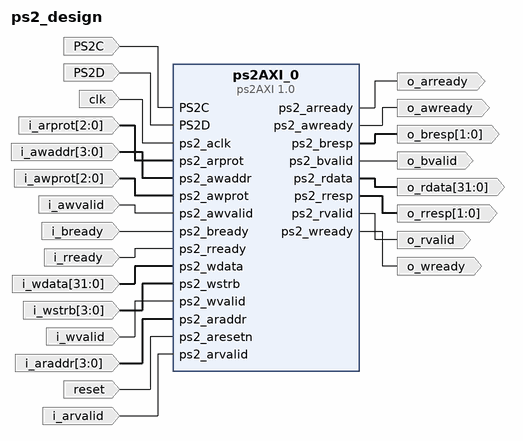
[diagram p0: block diagram of the top level]
# Vivado block design ps2_design, xc7z010clg400-1, Vivado 2023.1
create_bd_design ps2_design

create_bd_port -dir I reset
create_bd_port -dir I -type clk clk
set_property -dict {CONFIG.FREQ_HZ 125000000} [get_bd_ports clk]
create_bd_port -dir I -type data PS2C
create_bd_port -dir I -type data PS2D
create_bd_port -dir I -from 3 -to 0 i_araddr
create_bd_port -dir I i_arvalid
create_bd_port -dir O o_rvalid
create_bd_port -dir I -from 2 -to 0 i_arprot
create_bd_port -dir O o_arready
create_bd_port -dir O -from 31 -to 0 o_rdata
create_bd_port -dir O -from 1 -to 0 o_rresp
create_bd_port -dir I i_rready
create_bd_port -dir I i_bready
create_bd_port -dir O o_bvalid
create_bd_port -dir O -from 1 -to 0 o_bresp
create_bd_port -dir O o_wready
create_bd_port -dir I i_wvalid
create_bd_port -dir I -from 3 -to 0 i_wstrb
create_bd_port -dir I -from 31 -to 0 i_wdata
create_bd_port -dir I -from 3 -to 0 i_awaddr
create_bd_port -dir I -from 2 -to 0 i_awprot
create_bd_port -dir I i_awvalid
create_bd_port -dir O o_awready

create_bd_cell -type ip -vlnv user.org:user:ps2AXI:1.0 ps2AXI_0

# ---- connections ----

connect_bd_net [get_bd_ports PS2C] [get_bd_pins ps2AXI_0/PS2C]
connect_bd_net [get_bd_ports PS2D] [get_bd_pins ps2AXI_0/PS2D]
connect_bd_net [get_bd_ports clk] [get_bd_pins ps2AXI_0/ps2_aclk]
connect_bd_net [get_bd_ports i_arprot] [get_bd_pins ps2AXI_0/ps2_arprot]
connect_bd_net [get_bd_ports i_awaddr] [get_bd_pins ps2AXI_0/ps2_awaddr]
connect_bd_net [get_bd_ports i_awprot] [get_bd_pins ps2AXI_0/ps2_awprot]
connect_bd_net [get_bd_ports i_awvalid] [get_bd_pins ps2AXI_0/ps2_awvalid]
connect_bd_net [get_bd_ports i_bready] [get_bd_pins ps2AXI_0/ps2_bready]
connect_bd_net [get_bd_ports i_rready] [get_bd_pins ps2AXI_0/ps2_rready]
connect_bd_net [get_bd_ports i_wdata] [get_bd_pins ps2AXI_0/ps2_wdata]
connect_bd_net [get_bd_ports i_wstrb] [get_bd_pins ps2AXI_0/ps2_wstrb]
connect_bd_net [get_bd_ports i_wvalid] [get_bd_pins ps2AXI_0/ps2_wvalid]
connect_bd_net [get_bd_pins ps2AXI_0/ps2_arready] [get_bd_ports o_arready]
connect_bd_net [get_bd_pins ps2AXI_0/ps2_awready] [get_bd_ports o_awready]
connect_bd_net [get_bd_pins ps2AXI_0/ps2_bresp] [get_bd_ports o_bresp]
connect_bd_net [get_bd_pins ps2AXI_0/ps2_bvalid] [get_bd_ports o_bvalid]
connect_bd_net [get_bd_pins ps2AXI_0/ps2_rdata] [get_bd_ports o_rdata]
connect_bd_net [get_bd_pins ps2AXI_0/ps2_rresp] [get_bd_ports o_rresp]
connect_bd_net [get_bd_pins ps2AXI_0/ps2_rvalid] [get_bd_ports o_rvalid]
connect_bd_net [get_bd_pins ps2AXI_0/ps2_wready] [get_bd_ports o_wready]
connect_bd_net -net read_address_1 [get_bd_ports i_araddr] [get_bd_pins ps2AXI_0/ps2_araddr]
connect_bd_net [get_bd_ports reset] [get_bd_pins ps2AXI_0/ps2_aresetn]
connect_bd_net -net valid_address_1 [get_bd_ports i_arvalid] [get_bd_pins ps2AXI_0/ps2_arvalid]

validate_bd_design
save_bd_design
